# Altium schematic sheet TRANSLATOR_I2C.SchDoc: TRANSLATOR I2C
size A4; Author: Silvio Navaretti; CompanyName: ARDUINO SRL; DrawnBy: Silvio Navaretti; Engineer: Silvio Navaretti; Organization: ARDUINO SRL; DocumentNumber: ASX00083; SheetNumber: 4; SheetTotal: 11; RevAuthor: Silvio Navaretti
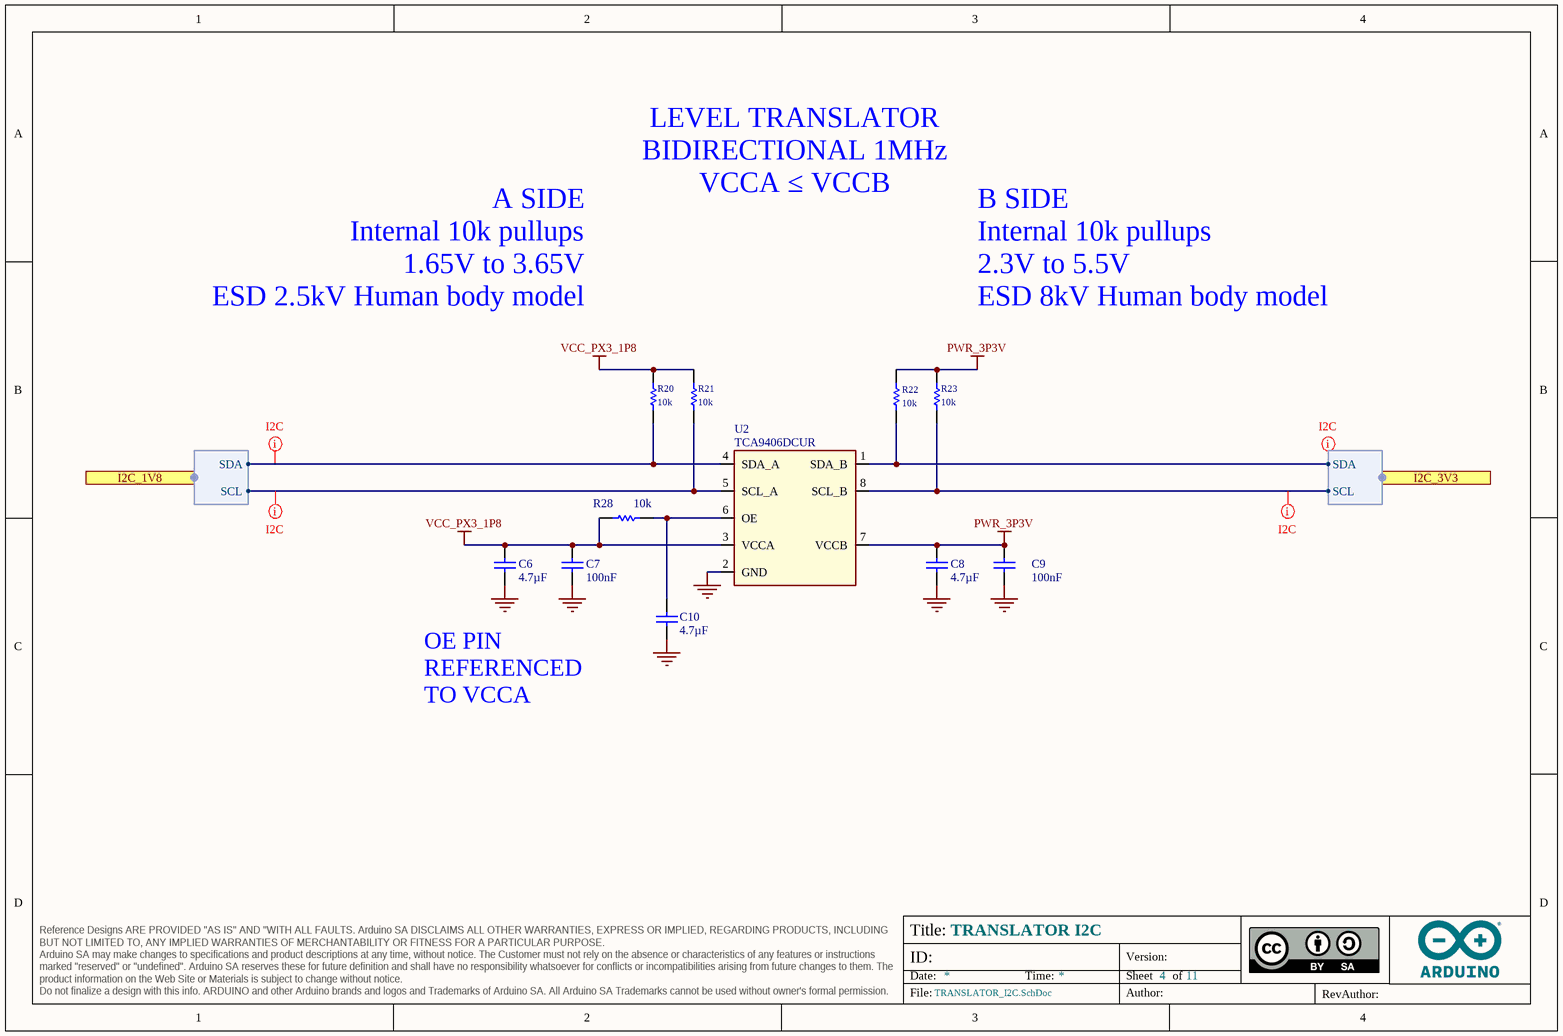
[diagram p0: TRANSLATOR_I2C.SchDoc]

## Parts
C6  value 4.7µF  [CAP-0402]  (hidden comment: C1005A475M6R3NT)
C7  value 100nF  [CAP-0402]  (hidden comment: GRM155R61H104KE19D)
C8  value 4.7µF  [CAP-0402]  (hidden comment: C1005A475M6R3NT)
C9  value 100nF  [CAP-0402]  (hidden comment: GRM155R61H104KE19D)
C10  value 4.7µF  [CAP-0402]  (hidden comment: C1005A475M6R3NT)
R20  value 10k  [RES-0402]  (hidden comment: CRCW040210K0FKED)
R21  value 10k  [RES-0402]  (hidden comment: CRCW040210K0FKED)
R22  value 10k  [RES-0402]  (hidden comment: CRCW040210K0FKED)
R23  value 10k  [RES-0402]  (hidden comment: CRCW040210K0FKED)
R28  value 10k  [RES-0402]  (hidden comment: CRCW040210K0FKED)
U2  TCA9406DCUR  [VSSOP8 pitch 0.5mm body 3.1x2x0.9mm]

## Ports
I2C_1V8 (harness I2C), I2C_3V3 (harness I2C)

## Harnesses
I2C: SDA, SCL

## Nets
GND: C6.1 C7.2 C8.1 C9.2 C10.1 U2.2(GND)
PWR_3P3V: C8.2 C9.1 R22.2 R23.2 U2.7(VCCB)
VCC_PX3_1P8: C6.2 C7.1 R20.2 R21.2 R28.2 U2.3(VCCA)
NetC10_2: C10.2 R28.1 U2.6(OE)
NetR20_1: R20.1 U2.4(SDA_A) ; port I2C_1V8.SDA
NetR21_1: R21.1 U2.5(SCL_A) ; port I2C_1V8.SCL
NetR22_1: R22.1 U2.1(SDA_B) ; port I2C_3V3.SDA
NetR23_1: R23.1 U2.8(SCL_B) ; port I2C_3V3.SCL

## Layout directives
net class I2C: NetR20_1, NetR21_1, NetR22_1, NetR23_1

## Notes on the sheet
- LEVEL TRANSLATOR
  BIDIRECTIONAL 1MHz
  VCCA ≤ VCCB
- A SIDE
  Internal 10k pullups
  1.65V to 3.65V
  ESD 2.5kV Human body model
- B SIDE
  Internal 10k pullups
  2.3V to 5.5V
  ESD 8kV Human body model
- OE PIN REFERENCED TO VCCA
- Title:
- ID:
- Date:
- Time:
- Version:
- Sheet
- of
- RevAuthor:
- Reference Designs ARE PROVIDED "AS IS" AND "WITH ALL FAULTS. Arduino SA DISCLAIMS ALL OTHER WARRANTIES, EXPRESS OR IMPLIED, REGARDING PRODUCTS, INCLUDING BUT NOT LIMITED TO, ANY IMPLIED WARRANTIES OF MERCHANTABILITY OR FITNESS FOR A PARTICULAR PURPOSE.
  Arduino SA may make changes to specifications and product descriptions at any time, without notice. The Customer must not rely on the absence or characteristics of any features or instructions marked "reserved" or "undefined". Arduino SA reserves these for future definition and shall have no responsibility whatsoever for conflicts or incompatibilities arising from future changes to them. The product information on the Web Site or Materials is subject to change without notice.
  Do not finalize a design with this info. ARDUINO and other Arduino brands and logos and Trademarks of Arduino SA. All Arduino SA Trademarks cannot be used without owner's formal permission.
- File:
- Author:

## Library data of the parts
C6 C8 C10 = C0037-A.14: CAP CHIP 0402 4.7uF 20% 6V3 X5R; Manufacturer: Hottech; Code Arduino: 0833; Voltage: 6.3V; Dielectric: X5R; Technology: Ceramic; Part Number: C1005A475M6R3NT; Manufacturer 2: Samsung Electro-Mechanics; Case Code (Imperial): 0402; Tolerance: 20%; Manufacturer 3: Murata Electronics; Part number 3: GRM155R60J475ME47D; Part number 2: CL05A475KQ5NRNC
C7 C9 = C0015-A.14: CAP CHIP 0402 100nF 10% 50V X5R; Manufacturer: Murata; Code Arduino: A5141; Dielectric: X5R; Part Number: GRM155R61H104KE19D; Tolerance: 10%; Voltage: 50V; Case Code (Imperial): 0402; Technology: Ceramic
R20-R23 R28 = R0003-A.24: RES CHIP 0402 10k 1% 1/16W; Manufacturer: Vishay; Code Arduino: 0136; Power: 62.5mW; Temperature coefficient: 100ppm; Case Code (Imperial): 0402; Part Number: CRCW040210K0FKED; Technology: Thick film; Tolerance: 1%
U2 = U0087-A.10: IC Translator 2b,  Push pull, OE, VCCA 1.65V to 3.6V, VCCB 2.3V to 5.5V, internal 10k pullups, Iq 2uA when VCCA or VCCB at 0V, VSSOP8 3.1x2x0.9mm; Manufacturer: Texas Instruments; Code Arduino: A5381; Part Number: TCA9406DCUR; LCSC Part #: C840107